# Altium schematic sheet USB.SchDoc
size A4
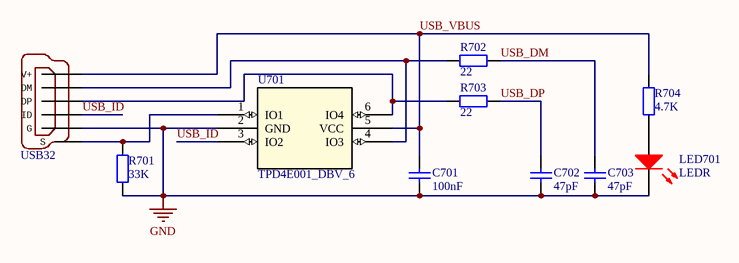
[diagram p0: USB.SchDoc]

## Parts
C701  value 100nF  [0603C]  (hidden comment: MLCC)
C702  value 47pF  [0603C]  (hidden comment: MLCC)
C703  value 47pF  [0603C]  (hidden comment: MLCC)
LED701  LEDR  [LED1206R]
R701  value 33K  [0603R]  (hidden comment: Resistor)
R702  value 22  [0603R]  (hidden comment: Resistor)
R703  value 22  [0603R]  (hidden comment: Resistor)
R704  value 4.7K  [0603R]  (hidden comment: Resistor)
U701  TPD4E001_DBV_6  [DBV6]
USB32  MICRO-USB  [USB-MICRO]  (value not drawn)

## Nets
GND: C701.1 C702.1 C703.1 LED701.2(K) R701.1 U701.2(GND) USB32.1(G)
USB_DM: C703.2 R702.2
USB_DP: C702.2 R703.2
USB_ID: U701.3(IO2) USB32.2(ID)
USB_VBUS: C701.2 R704.2 U701.5(VCC) USB32.5(V+)
NetLED701_1: LED701.1(A) R704.1
NetR701_2: R701.2 U701.1(IO1) USB32.6(S)
NetR702_1: R702.1 U701.4(IO3) USB32.4(DM)
NetR703_1: R703.1 U701.6(IO4) USB32.3(DP)

## Library data of the parts
LED701 = LEDR: RED LED
U701 = TPD4E001_DBV_6: Low-Capacitance 4-Channel ESD-Protection for High-Speed Data Interfaces; Vendor: Texas Instruments; PACKAGE_DESIGNATOR: DBV; PIN_COUNT: 6; FAMILY_NAME: ESD Solution; INDUSTRY_STD_PKG_TYPE: SOT-23; Manufacturer_Part_Number: tpd4e001_dbv_6; GENERIC_PART_NUMBER: TPD4E001; Datasheet URL: http://www.ti.com/lit/gpn/TPD4E001; Manufacturer: Texas Instruments; RefDes: RefDes; Type: DEV; Value: Value
USB32 = MICRO-USB: MICRO USB Connector